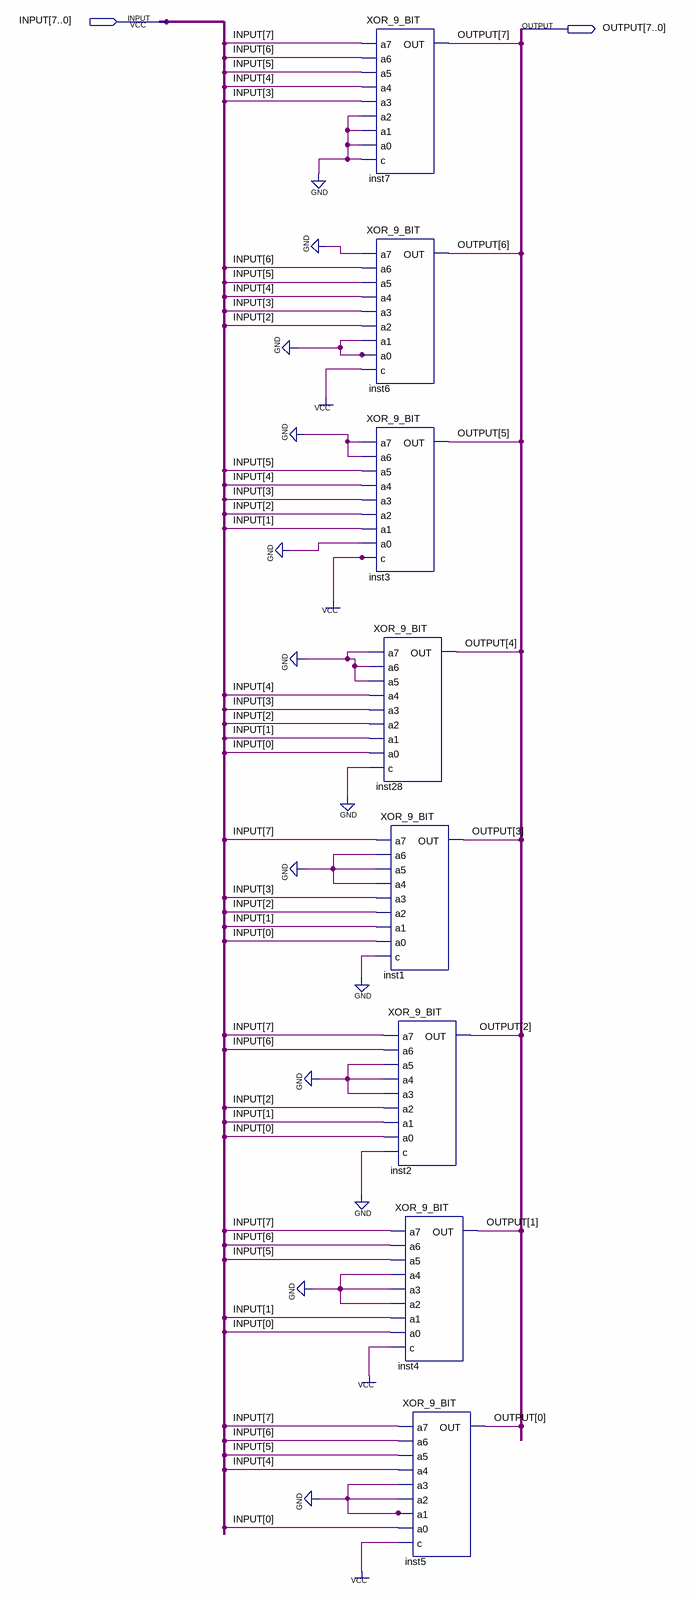
[diagram p0: schematic sheet]
// Quartus schematic AFFINE_TRANSFORMATION_8BIT.bdf as structural Verilog: 8 symbols, 2 pins
module AFFINE_TRANSFORMATION_8BIT (
  input  [7:0] INPUT,
  output [7:0] OUTPUT
);

  XOR_9_BIT inst7 (
    .a7(INPUT[7]), .a6(INPUT[6]), .a5(INPUT[5]), .a4(INPUT[4]), .a3(INPUT[3]), .a2(1'b0), .a1(1'b0),
    .a0(1'b0), .c(1'b0), .OUT(OUTPUT[7]));
  XOR_9_BIT inst6 (
    .a7(1'b0), .a6(INPUT[6]), .a5(INPUT[5]), .a4(INPUT[4]), .a3(INPUT[3]), .a2(INPUT[2]), .a1(1'b0),
    .a0(1'b0), .c(1'b1), .OUT(OUTPUT[6]));
  XOR_9_BIT inst3 (
    .a7(1'b0), .a6(1'b0), .a5(INPUT[5]), .a4(INPUT[4]), .a3(INPUT[3]), .a2(INPUT[2]), .a1(INPUT[1]),
    .a0(1'b0), .c(1'b1), .OUT(OUTPUT[5]));
  XOR_9_BIT inst28 (
    .a7(1'b0), .a6(1'b0), .a5(1'b0), .a4(INPUT[4]), .a3(INPUT[3]), .a2(INPUT[2]), .a1(INPUT[1]),
    .a0(INPUT[0]), .c(1'b0), .OUT(OUTPUT[4]));
  XOR_9_BIT inst1 (
    .a7(INPUT[7]), .a6(1'b0), .a5(1'b0), .a4(1'b0), .a3(INPUT[3]), .a2(INPUT[2]), .a1(INPUT[1]),
    .a0(INPUT[0]), .c(1'b0), .OUT(OUTPUT[3]));
  XOR_9_BIT inst2 (
    .a7(INPUT[7]), .a6(INPUT[6]), .a5(1'b0), .a4(1'b0), .a3(1'b0), .a2(INPUT[2]), .a1(INPUT[1]),
    .a0(INPUT[0]), .c(1'b0), .OUT(OUTPUT[2]));
  XOR_9_BIT inst4 (
    .a7(INPUT[7]), .a6(INPUT[6]), .a5(INPUT[5]), .a4(1'b0), .a3(1'b0), .a2(1'b0), .a1(INPUT[1]),
    .a0(INPUT[0]), .c(1'b1), .OUT(OUTPUT[1]));
  XOR_9_BIT inst5 (
    .a7(INPUT[7]), .a6(INPUT[6]), .a5(INPUT[5]), .a4(INPUT[4]), .a3(1'b0), .a2(1'b0), .a1(1'b0),
    .a0(INPUT[0]), .c(1'b1), .OUT(OUTPUT[0]));
endmodule
